# EAGLE design Pit Crew (EAGLE 6.6.0)

## Sheet 1 of 2
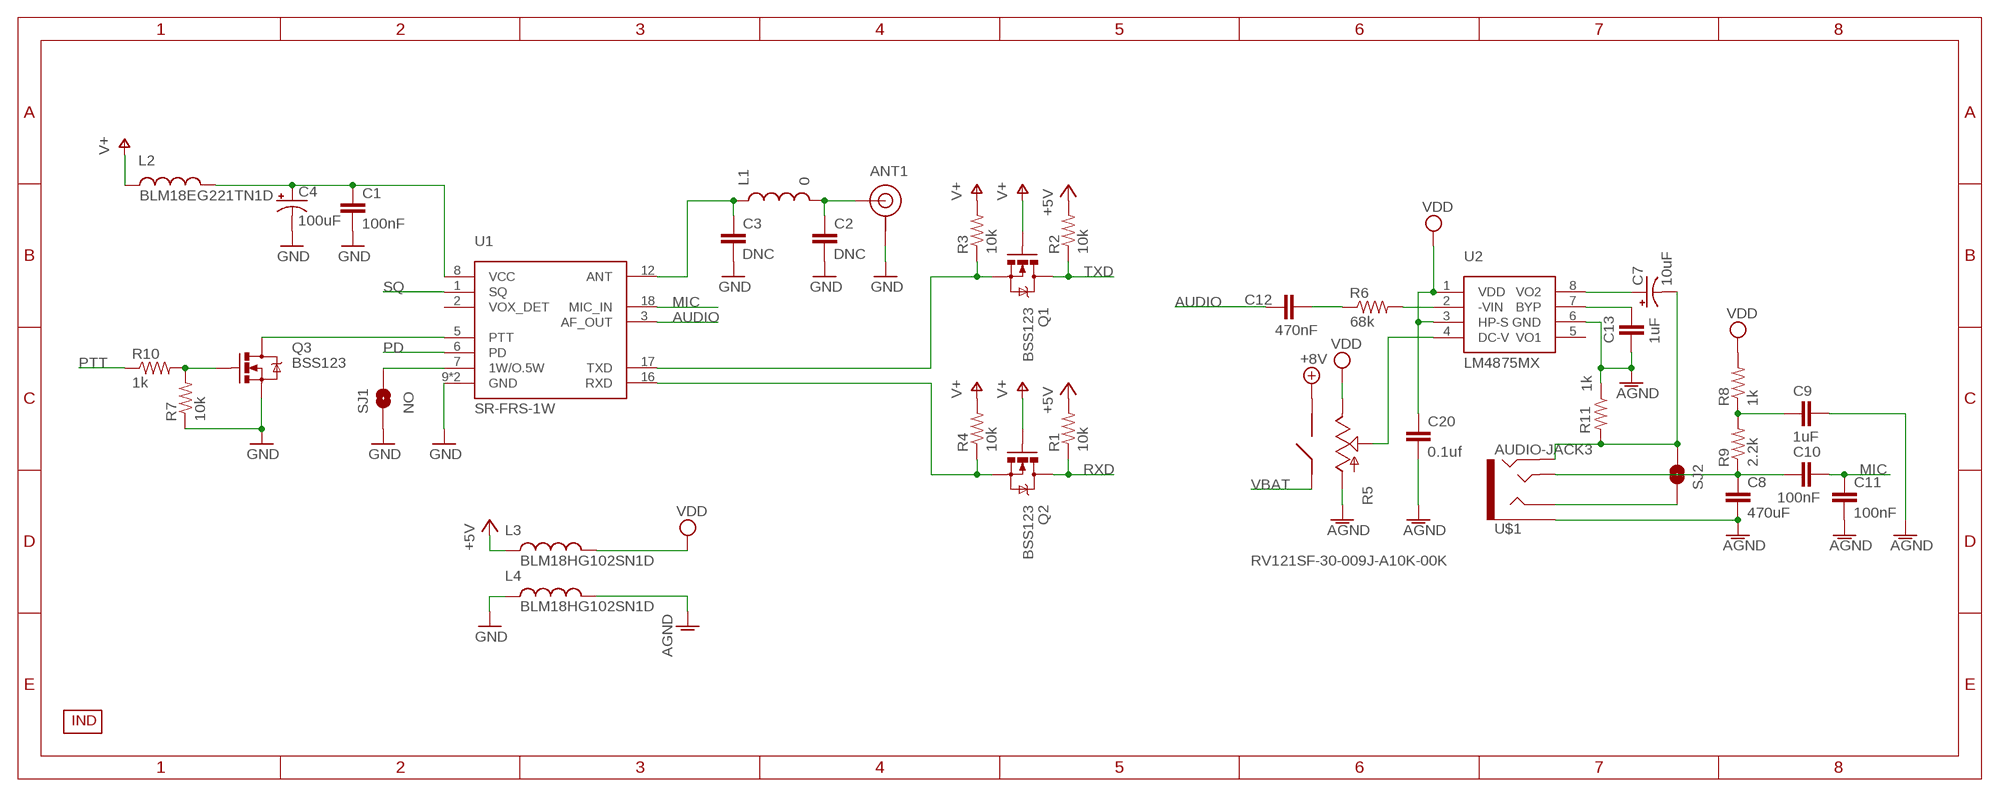
[diagram p0: schematic, sheet 1]

### Parts
ANT1  SMA  [CONSMA002]
C1  100nF  CAP0805  [0805]
C2  DNC  CAP0805  [0805]
C3  DNC  CAP0805  [0805]
C4  100uF  CAP_POL1206  [EIA3216]
C7  10uF  10UF-TANT  [EIA3216]
C8  470uF  CAP0805  [0805]
C9  1uF  CAP0805  [0805]
C10  100nF  CAP0805  [0805]
C11  100nF  CAP0805  [0805]
C12  470nF  CAP0805  [0805]
C13  1uF  CAP0805  [0805]
C20  0.1uf  CAP0805  [0805]
L1  0  INDUCTOR1007  [1007]
L2  BLM18EG221TN1D  INDUCTOR0603  [0603]
L3  BLM18HG102SN1D  INDUCTOR0603  [0603]
L4  BLM18HG102SN1D  INDUCTOR0603  [0603]
Q1  BSS123  MOSFET-NCHANNELBSS123LT1G  [SOT23]
Q2  BSS123  MOSFET-NCHANNELBSS123LT1G  [SOT23]
Q3  BSS123  MOSFET-NCHANNELBSS123LT1G  [SOT23]
R1  10k  RESISTOR0805-RES  [0805]
R2  10k  RESISTOR0805-RES  [0805]
R3  10k  RESISTOR0805-RES  [0805]
R4  10k  RESISTOR0805-RES  [0805]
R5  RV121SF-30-009J-A10K-00K  [RV121SF-30-009J-A10K-00K]
R6  68k  RESISTOR0805-RES  [0805]
R7  10k  RESISTOR0805-RES  [0805]
R8  1k  RESISTOR0805-RES  [0805]
R9  2.2k  RESISTOR0805-RES  [0805]
R10  1k  RESISTOR0805-RES  [0805]
R11  1k  RESISTOR0805-RES  [0805]
SJ1  NO  SOLDERJUMPERNO  [SJ_2S-NO]
SJ2  SOLDERJUMPERNO  [SJ_2S-NO]
U1  SR-FRS-1W  [SR-FRS-1W]
U2  LM4875MX  [SO-8]
U$1  AUDIO-JACK3  [AUDIO-JACK-TRRS-SMD]
U$3  INDPK1  [PICKIT-PIN-1]

### Nets
+5V: L3.1 R1.2 R2.2 ; also sheet 2
+8V: R5.S-A(S1) ; also sheet 2
AGND: C8.2 C9.2 C11.2 C13.1 C20.2 L4.2 R5.CC(A) R11.1 U2.6(GND) U$1.EARTH
AUDIO: C12.1 U1.3(AF_OUT)
GND: ANT1.1(GND) ANT1.2(GND) ANT1.3(GND) ANT1.4(GND) C1.2 C2.2 C3.2 C4.C(-) L4.1 Q3.2(S) R7.1 SJ1.1 U1.9(GND) U1.10(GND) ; also sheet 2
MIC: C10.2 C11.1 U1.18(MIC_IN)
N$1: C3.1 L1.1 U1.12(ANT)
N$2: ANT1.C(SIGNAL) C2.1 L1.2
N$3: C1.1 C4.A(+) L2.2 U1.8(VCC)
N$4: SJ1.2 U1.7(1W/O.5W)
N$5: SJ2.1 U$1.RING1
N$6: C7.C(-) R11.2 SJ2.2 U$1.RING2
N$7: R5.W(S) U2.4(DC-V)
N$8: Q2.2(S) R4.1 U1.16(RXD)
N$9: Q1.2(S) R3.1 U1.17(TXD)
N$10: C13.2 U2.7(BYP)
N$12: C12.2 R6.1
N$14: R6.2 U2.2(-VIN)
N$15: C9.1 R8.1 R9.2
N$16: C8.1 C10.1 R9.1 U$1.TIP
N$17: C7.A(+) U2.8(VO2)
N$18: Q3.1(G) R7.2 R10.2
PD: U1.6(PD) ; also sheet 2
PTT: R10.1 ; also sheet 2
PTT-1: Q3.3(D) U1.5(PTT)
RXD: Q2.3(D) R1.1 ; also sheet 2
SQ: U1.1(SQ)
TXD: Q1.3(D) R2.1 ; also sheet 2
V+: L2.1 Q1.1(G) Q2.1(G) R3.2 R4.2 ; also sheet 2
VBAT: R5.S-B(S2) ; also sheet 2
VDD: C20.1 L3.2 R5.CCW(E) R8.2 U2.1(VDD) U2.3(HP-S)
Unconnected: U1.2(VOX_DET) U2.5(VO1)

## Sheet 2 of 2
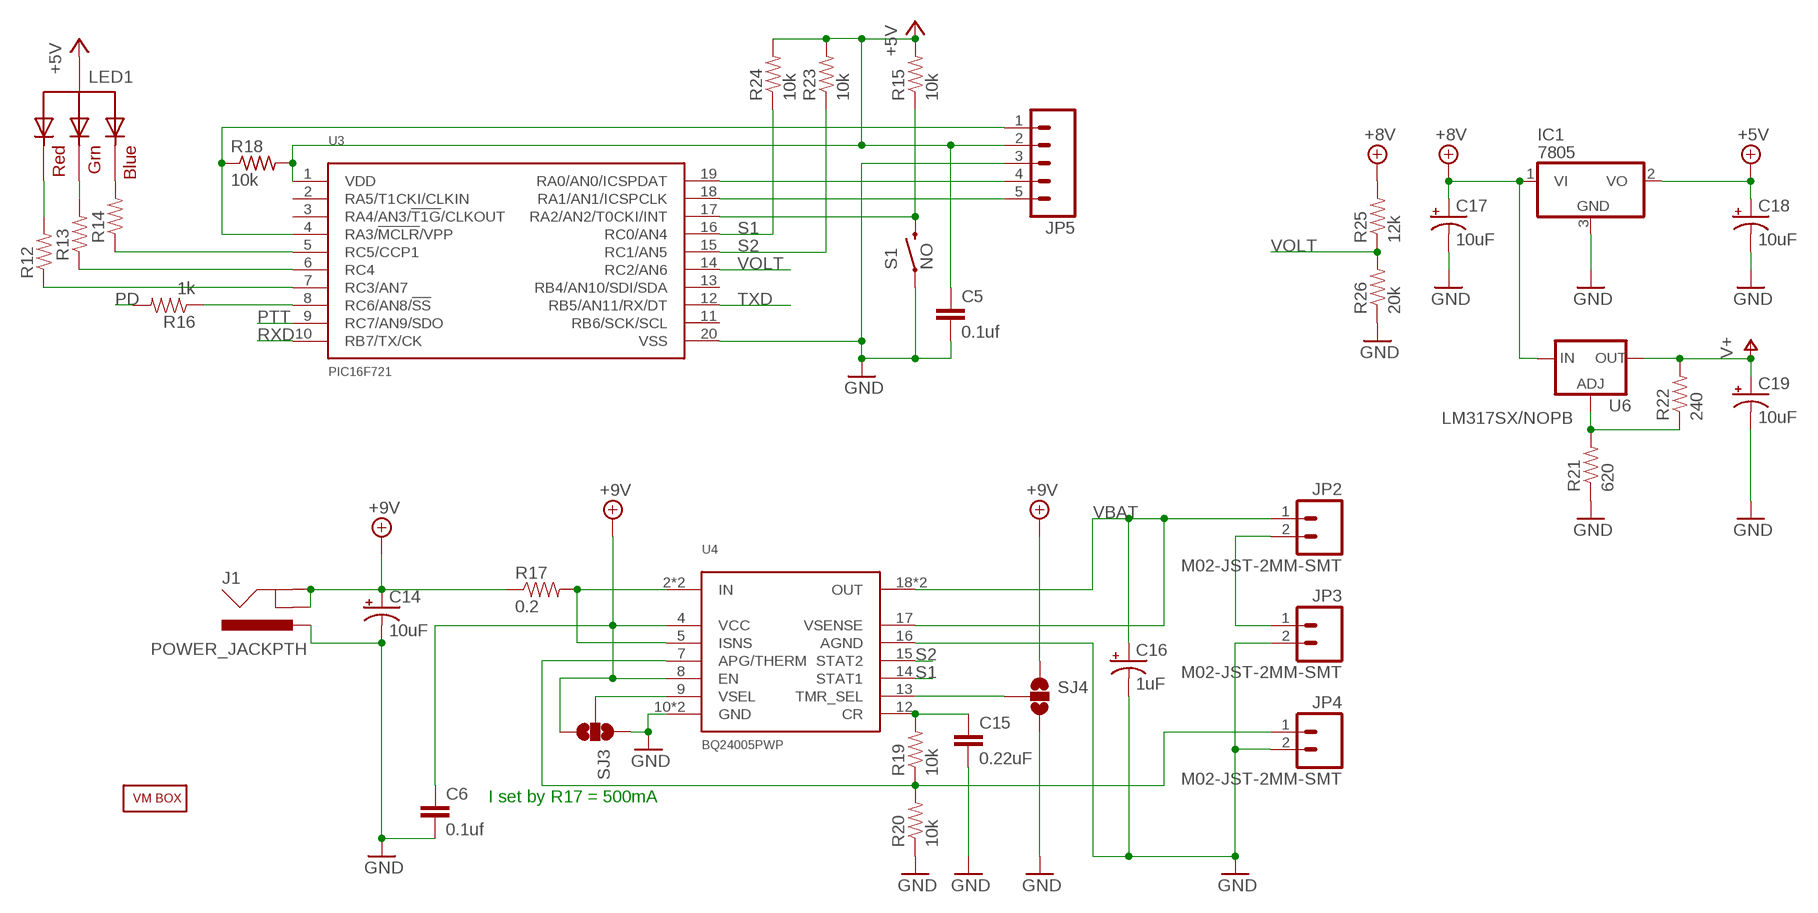
[diagram p1: schematic, sheet 2]

### Parts
C5  0.1uf  CAP0805  [0805]
C6  0.1uf  CAP0805  [0805]
C14  10uF  10UF-TANT  [EIA3216]
C15  0.22uF  CAP0805  [0805]
C16  1uF  10UF-TANT  [EIA3216]
C17  10uF  10UF-TANT  [EIA3216]
C18  10uF  10UF-TANT  [EIA3216]
C19  10uF  10UF-TANT  [EIA3216]
IC1  7805  7806DT  [TO252]
J1  POWER_JACKPTH  [POWER_JACK_PTH]
JP2  M02-JST-2MM-SMT  [JST-2-SMD]
JP3  M02-JST-2MM-SMT  [JST-2-SMD]
JP4  M02-JST-2MM-SMT  [JST-2-SMD]
JP5  M05LOCK_LONGPADS  [1X05_LOCK_LONGPADS]
LED1  RGBLED_CA-5MM  [LED5MMRGB]
R12  RESISTOR0805-RES  [0805]
R13  RESISTOR0805-RES  [0805]
R14  RESISTOR0805-RES  [0805]
R15  10k  RESISTOR0805-RES  [0805]
R16  1k  RESISTOR0805-RES  [0805]
R17  0.2  RESISTOR2512  [R2512]
R18  10k  R-US_R0805  [R0805]
R19  10k  RESISTOR0805-RES  [0805]
R20  10k  RESISTOR0805-RES  [0805]
R21  620  RESISTOR0805-RES  [0805]
R22  240  RESISTOR0805-RES  [0805]
R23  10k  RESISTOR0805-RES  [0805]
R24  10k  RESISTOR0805-RES  [0805]
R25  12k  RESISTOR0805-RES  [0805]
R26  20k  RESISTOR0805-RES  [0805]
S1  NO  SWITCH-MOMENTARY-2SIDE_EZ  [TACTILE-PTH-SIDEEZ]
SJ3  SOLDERJUMPER_2WAYS  [SJ_3]
SJ4  SOLDERJUMPER_2WAYS  [SJ_3]
U3  PIC16F721  [SSOP-20]
U4  BQ24005PWP  [HTSSOP-20]
U6  LM317SX/NOPB  V_REG_317  [D2PACK/A]
U$2  VM  [VM-35]

### Nets
+5V: C5.1 C18.A(+) IC1.2(VO) JP5.2 LED1.2(VCC) R15.2 R18.2 R23.2 R24.2 U3.1(VDD) ; also sheet 1
+8V: C17.A(+) IC1.1(VI) R25.2 U6.3(IN) ; also sheet 1
+9V: C6.1 C14.A(+) J1.GND J1.GNDBREAK R17.1 SJ3.3 SJ4.1 U4.4(VCC) U4.8(EN)
GND: C5.2 C6.2 C14.C(-) C15.2 C16.C(-) C17.C(-) C18.C(-) C19.C(-) IC1.3(GND) J1.PWR JP3.2 JP4.2 JP5.3 R20.1 R21.1 R26.1 S1.1 SJ3.1 SJ4.3 U3.20(VSS) U4.10(GND) U4.16(AGND) U4.EP(GND) ; also sheet 1
N$11: LED1.1(RED) R12.2
N$13: LED1.4(BLUE) R14.2
N$19: LED1.3(GREEN) R13.2
N$21: R14.1 U3.5(RC5/CCP1)
N$22: R13.1 U3.6(RC4)
N$23: R12.1 U3.7(RC3/AN7)
N$24: R15.1 S1.2
N$25: R16.1 U3.8(RC6/AN8/!SS!)
N$27: JP5.1 R18.1 U3.4(RA3/!MCLR!/VPP)
N$28: JP5.4 U3.19(RA0/AN0/ICSPDAT)
N$29: JP5.5 U3.18(RA1/AN1/ICSPCLK)
N$30: JP2.2 JP3.1
N$31: R17.2 U4.2(IN) U4.3(IN) U4.5(ISNS)
N$32: R21.2 R22.1 U6.1(ADJ)
N$33: SJ3.2 U4.9(VSEL)
N$34: JP4.1 R19.1 R20.2 U4.7(APG/THERM)
N$35: C15.1 R19.2 U4.12(CR)
N$36: SJ4.2 U4.13(TMR_SEL)
PD: R16.2 ; also sheet 1
PTT: U3.9(RC7/AN9/SDO) ; also sheet 1
RXD: U3.10(RB7/TX/CK) ; also sheet 1
S1: R24.1 U3.16(RC0/AN4) U4.14(STAT1)
S2: R23.1 U3.15(RC1/AN5) U4.15(STAT2)
TXD: U3.12(RB5/AN11/RX/DT) ; also sheet 1
V+: C19.A(+) R22.2 U6.2(OUT) U6.TAB(OUT) ; also sheet 1
VBAT: C16.A(+) JP2.1 U4.17(VSENSE) U4.18(OUT) U4.19(OUT) ; also sheet 1
VOLT: R25.1 R26.2 U3.14(RC2/AN6)
Unconnected: U3.2(RA5/T1CKI/CLKIN) U3.3(RA4/AN3/!T1G!/CLKOUT) U3.11(RB6/SCK/SCL) U3.13(RB4/AN10/SDI/SDA) U3.17(RA2/AN2/T0CKI/INT)

### Notes on the sheet
- I set by R17 = 500mA

## Library data of the parts
ANT1 = FSAE Eletric:SMA
C1-C3 C8-C13 C15 C20 = SparkFun-Passives:CAP: Capacitor Standard 0603 ceramic capacitor, and 0.1" leaded capacitor.
C4 = SparkFun-Passives:CAP_POL: Capacitor Polarized These are standard SMD and PTH capacitors. Normally 10uF, 47uF, and 100uF in electrolytic and tantalum varieties. Always verify the external diameter of the through hole cap, it varies with capacity, voltage, and manufacturer. The EIA devices should be standard.
C5 C6 = SparkFun-Capacitors:CAP: Capacitor Standard 0603 ceramic capacitor, and 0.1" leaded capacitor.
C7 C14 C17-C19 = SparkFun-Capacitors:10UF-TANT: 10uF Tantalum SMT CAP-00811- 16V 10% (EIA-3216); PROD_ID: CAP-00811
C16 = SparkFun-Capacitors:10UF-TANT: 10uF Tantalum SMT CAP-00811- 16V 10% (EIA-3216); PROD_ID: CAP-00811; VALUE: 10uF
IC1 = adafruit:78*: Positive VOLTAGE REGULATOR Added bigger pads to the TO-92 package
J1 = SparkFun-Connectors:POWER_JACK: Power Jack This is the standard 5.5mm barrel jack for power. The PTH is the most common, proven, reliable, footprint. The Slot footprint only works if the mill layer is transmitted to the PCB fab house so be warned. Spark Fun Electronics SKU : PRT-00119 SMT: CONN-08106 Mating wall wart : TOL-00298 (and others)
JP2-JP4 = SparkFun-Connectors:M02: Standard 2-pin 0.1" header. Use with - straight break away headers ( PRT-00116) - right angle break away headers (PRT-00553) - swiss pins (PRT-00743) - machine pins (PRT-00117) - female headers (PRT-00115) Molex polarized connector foot print use with: PRT-08233 with associated crimp pins and housings. 2.54_SCREWTERM for use with PRT-10571. 3.5mm Screw Terminal footprints for PRT-08084 5mm Screw Terminal footprints for use with PRT-08433; PROD_ID: CONN-08352
JP5 = SparkFun-Connectors:M05: Header 5 Standard 5-pin 0.1" header. Use with straight break away headers (SKU : PRT-00116), right angle break away headers (PRT-00553), swiss pins (PRT-00743), machine pins (PRT-00117), and female headers (PRT-00115). Molex polarized connector foot print use with SKU : PRT-08230 with associated crimp pins and housings.
L1-L4 = SparkFun-Passives:INDUCTOR: Inductors Basic Inductor/Choke - 0603 and 1206. Footprints are not proven and vary greatly between part numbers. SRN6045- 33uH, 20% 1.4A
LED1 = adafruit:RGBLED_CA: RGB LED, common-anode 5MM Staggered pins 5mm Piranha package http://www.ladyada.net/library/pcb/eaglelibrary.html
Q1-Q3 = SparkFun-DiscreteSemi:MOSFET-NCHANNEL: Common NMOSFET Parts MFG P/N Store ID Prod ID FDD8780 TRANS-09984 SI7820DN TRANS-11055 FDS6630A IC-08089 2N7002PW TRANS-11151 FQP30N06L COM-10213 TRANS-10060 BSS123LT1G TRANS-08345 BSS138 TRANS-00830 BS170 2N7000; PROD_ID: TRANS-08345
R1-R4 R6-R17 R19-R26 = SparkFun-Passives:RESISTOR: Resistor Basic schematic elements and footprints for 0603, 1206, and PTH resistors.
R5 = FSAE Eletric:RV121SF-30-009J-A10K-00K
R18 = adafruit:R-US_: RESISTOR, American symbol
S1 = SparkFun-Electromechanical:SWITCH-MOMENTARY-2: Various NO switches- pushbuttons, reed, etc
SJ1 SJ2 = SparkFun-Passives:SOLDERJUMPER: Solder Jumper Standard SMD solder jumper. Used to automate production. Two varients : Normally Open and Normally Closed are the same, but have different paste layers. NC will have a large amount of paste and should jumper during reflow.
SJ3 SJ4 = SparkFun-Passives:SOLDERJUMPER_2WAY: Solder Jumper 2 way solder jumper
U1 = FSAE Eletric:SR-FRS-1W
U2 = FSAE Eletric:LM4875MX
U3 = FSAE Eletric:PIC16F721
U4 = FSAE Eletric:BQ24005PWP
U6 = SparkFun-PowerIC:V_REG_317: Voltage Regulator Standard LM317 adjustable voltage regulator. AOI (Adjust Output Input). Google 'LM317 Calculator' for easy to use app to get the two resistor values needed. 240/720 for 5V output. 240/390 for 3.3V output. Spark Fun Electronics SKU : COM-00527
U$1 = SparkFun-Connectors:AUDIO-JACK3: Audio jack - 3.5mm TRRS variety - two rings.
U$2 = FSAE Eletric:VM
U$3 = FSAE Eletric:IND

## Board
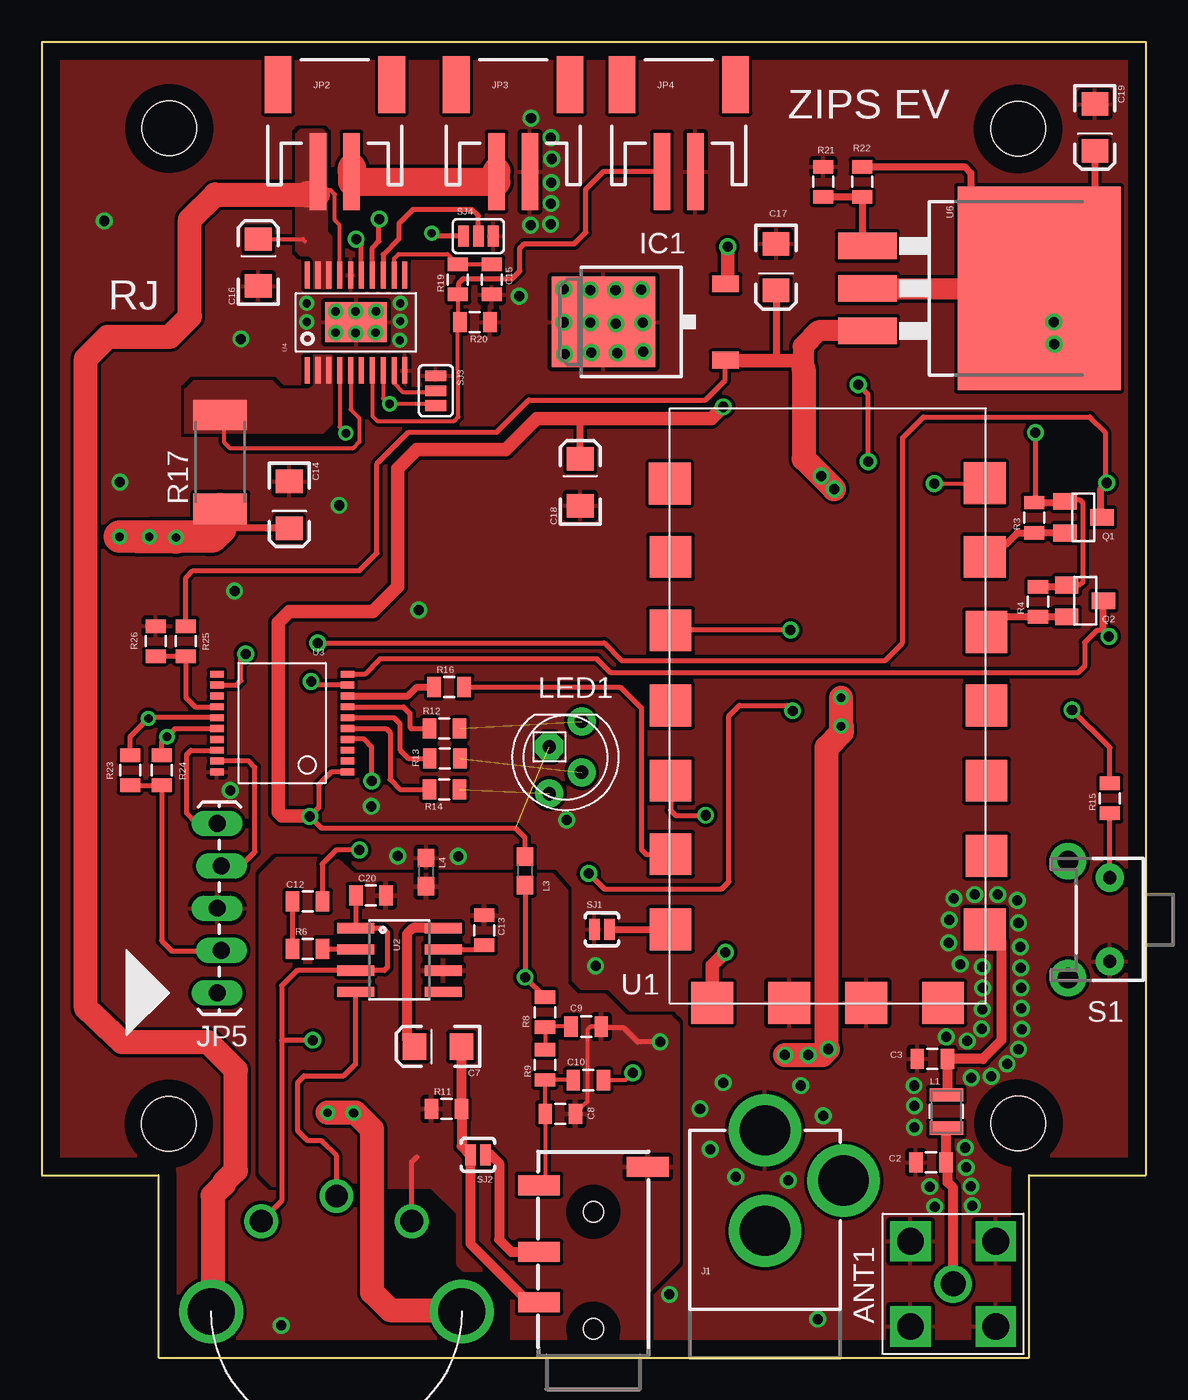
[diagram p2: board, top side]
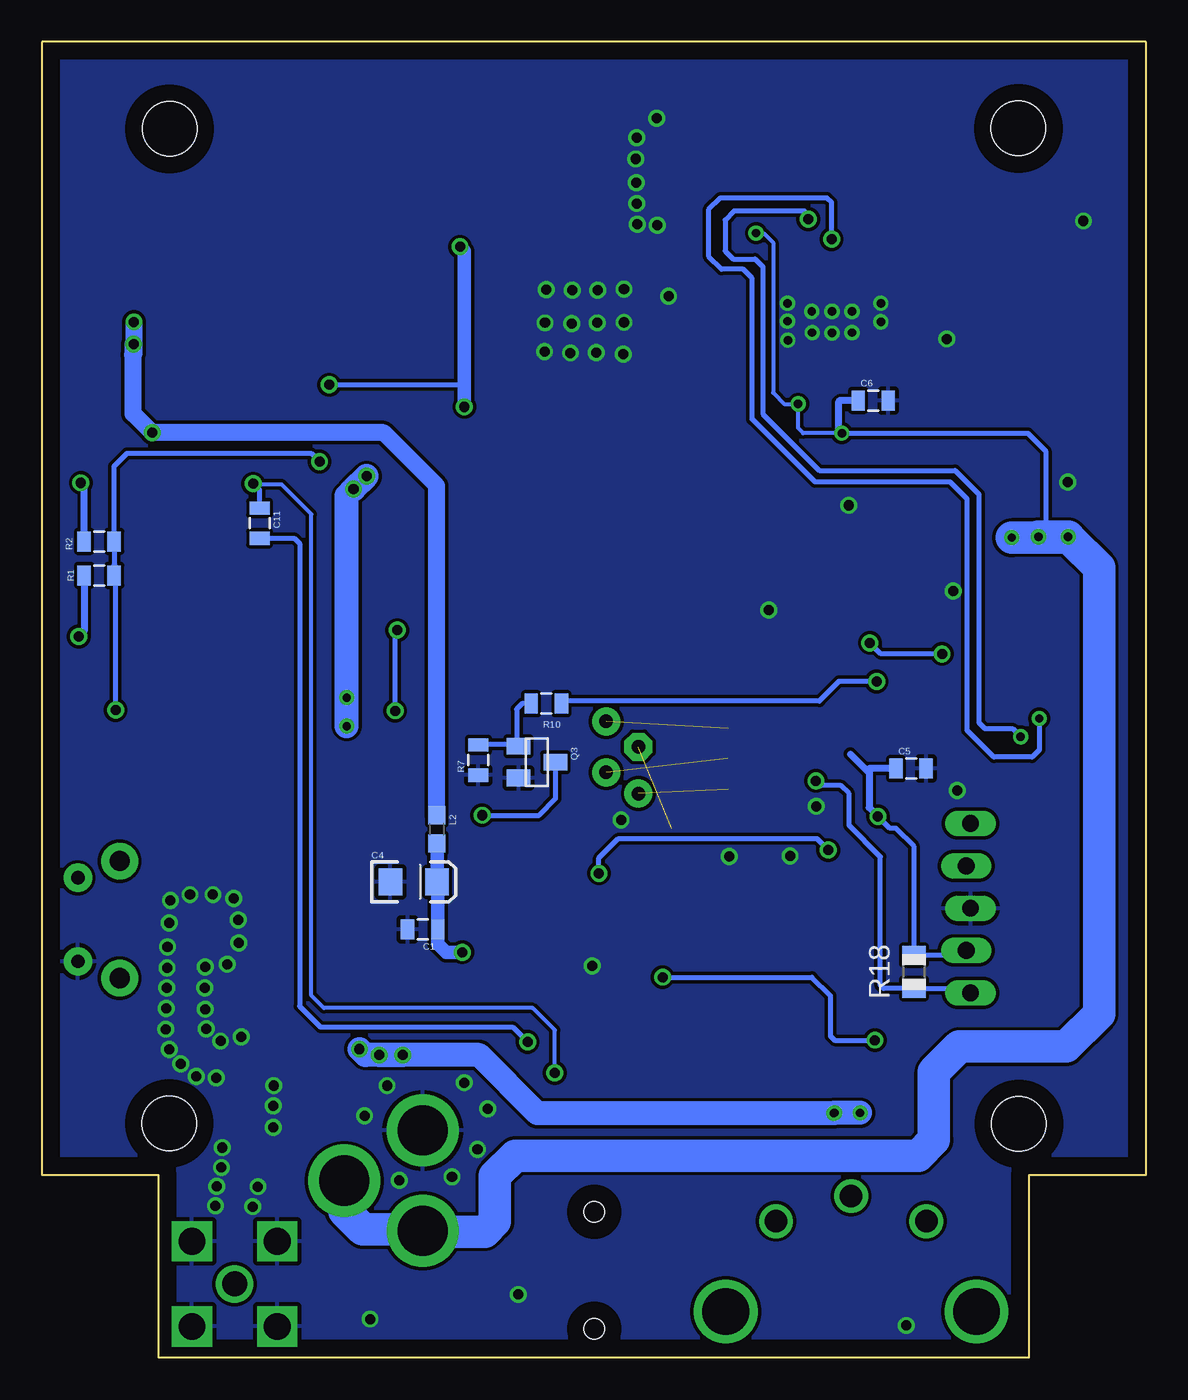
[diagram p3: board, bottom side, seen from below]

Size 66.04 x 78.74 mm. Coordinates in mm from the lower left corner, seen from the top.
Copper layers (1*16): Top 0.035mm / dielectric 1.5mm / Bottom 0.035mm
Design rules "default": minimum track width 10mil, minimum drill 24mil, track to track 8mil, track to pad 8mil, pad to pad 8mil, via to via 8mil, smd to smd 8mil, copper to edge 40mil, drill to drill 8mil, minimum pad ring 10mil, minimum via ring 8mil, stop-mask expansion 4mil, vias tented up to drill 0mil, thermal gap 10mil

### Footprints (pad centres in the part's own frame; a part is rotated, then mirrored left to right if it is on the bottom)
CONSMA002 = drill 1.6 square: 1 -2.55,2.55; 2 2.55,2.55; 3 2.55,-2.55; 4 -2.55,-2.55 | drill 1.5: C 0,0
0805 = smd 0.8 x 1.2: 1 -0.9,0; 2 0.9,0
EIA3216 = smd 1.4 x 1.6: A 1.4,0; C -1.4,0
TO252 = smd 1 x 1.6: 1 -2.28,-4.8; 2 2.28,-4.8 | smd 5.4 x 6.2: 3 0,2.5
POWER_JACK_PTH = drill 2.997 pad 4.318: GND 0,7.7; GNDBREAK 4.7,10.7; PWR 0,13.7
JST-2-SMD = smd 1 x 4.6: 1 -1,-3.7; 2 1,-3.7 | smd 1.6 x 3.4: NC1 -3.4,1.5; NC2 3.4,1.5
1X05_LOCK_LONGPADS = drill 1.016 long: 1 0,0; 2 2.54,-0.254; 3 5.08,0; 4 7.62,-0.254; 5 10.16,0
1007 = smd 2 x 0.8: 1 0,1; 2 0,-1
0603 = smd 1.1 x 1: 1 -0.85,0; 2 0.85,0
LED5MMRGB = drill 0.8 pad 1.676: 1 -2.159,0.968; 3 0.889,0.968; 4 2.159,-0.968 | drill 0.8 pad 1.676 octagon: 2 -0.635,-0.968
SOT23 = smd 1 x 1.4: 1 -0.95,-1.1; 2 0.95,-1.1; 3 0,1.1
RV121SF-30-009J-A10K-00K = drill 1.35: CC -4.5,-5.4; CCW 4.5,-5.4; W 0,-6.9 | drill 2.8: S-A -7.5,0; S-B 7.5,0
R2512 = smd 1.8 x 3.2: 1 -2.8,0; 2 2.8,0
R0805 = smd 1.1 x 1.4: 1 -1,0; 2 1,0
TACTILE-PTH-SIDEEZ = drill 0.8 pad 1.7: 1 -2.5,0; 2 2.5,0 | drill 1.2 pad 2.2: ANCHOR1 -3.5,2.5; ANCHOR2 3.5,2.5
SJ_2S-NO = smd 0.635 x 1.27: 1 -0.45,0; 2 0.45,0
SJ_3 = smd 0.635 x 1.27: 1 -0.889,0; 2 0,0; 3 0.889,0
SR-FRS-1W = smd 2.5 x 2.5: 1 0,31.1; 2 0.04,26.72; 3 0.04,22.32; 4 0.04,17.82; 5 0.04,13.32; 6 0.04,8.92; 7 0.04,4.42; 8 2.54,0.02; 9 7.14,0.02; 10 11.74,0.02; 11 16.34,0.02; 12 18.84,4.42; 13 18.94,8.82; 14 18.94,13.32; 15 18.94,17.82; 16 18.94,22.22; 17 18.84,26.72; 18 18.84,31.12
SO-8 = smd 0.61 x 2.21: 1 -1.905,-2.616; 2 -0.635,-2.616; 3 0.635,-2.616; 4 1.905,-2.616; 5 1.905,2.616; 6 0.635,2.616; 7 -0.635,2.616; 8 -1.905,2.616
SSOP-20 = smd 0.813 x 0.406: 1 -3.9,2.925; 2 -3.9,2.275; 3 -3.9,1.625; 4 -3.9,0.975; 5 -3.9,0.325; 6 -3.9,-0.325; 7 -3.9,-0.975; 8 -3.9,-1.625; 9 -3.9,-2.275; 10 -3.9,-2.925; 11 3.9,-2.925; 12 3.9,-2.275; 13 3.9,-1.625; 14 3.9,-0.975; 15 3.9,-0.325; 16 3.9,0.325; 17 3.9,0.975; 18 3.9,1.625; 19 3.9,2.275; 20 3.9,2.925
HTSSOP-20 = smd 0.3 x 1.6: 1 -2.925,-2.9; 2 -2.275,-2.9; 3 -1.625,-2.9; 4 -0.975,-2.9; 5 -0.325,-2.9; 6 0.325,-2.9; 7 0.975,-2.9; 8 1.625,-2.9; 9 2.275,-2.9; 10 2.925,-2.9; 11 2.925,2.8; 12 2.275,2.8; 13 1.625,2.8; 14 0.975,2.8; 15 0.325,2.8; 16 -0.325,2.8; 17 -0.975,2.8; 18 -1.625,2.8; 19 -2.275,2.8; 20 -2.925,2.8 | smd 3.7 x 2.4: EP 0,0
D2PACK/A = smd 1.6 x 3.5: 1 -2.54,-8.275; 2 0,-8.275; 3 2.54,-8.275 | smd 12.2 x 9.75: TAB 0,2
AUDIO-JACK-TRRS-SMD = smd 1.2 x 2.5: EARTH 11.3,-3.25; RING1 6.2,3.25; RING2 3.2,3.25; TIP 10.2,3.25 | hole 1.2: 1.6,0; 8.6,0
VM-35 = hole 3.251: -25.425,13.995; 25.4,14.021; 25.375,73.533; -25.4,73.558

### Placement (x,y rotation side)
ANT1  54.51,4.42 0 top
C1  43.26,25.63 180 bottom
C2  53.19,11.68 180 top
C3  53.26,17.88 180 top
C4  43.79,28.47 0 bottom
C5  14.05,35.26 0 bottom
C6  16.31,57.28 0 bottom
C7  23.7,18.62 180 top
C8  31.01,14.61 0 top
C9  32.56,19.81 0 top
C10  32.69,16.61 0 top
C11  53.01,49.94 270 bottom
C12  15.9,27.3 180 top
C13  26.47,25.58 270 top
C14  14.81,51.03 270 top
C15  26.92,64.52 270 top
C16  12.95,65.53 90 top
C17  43.92,65.25 270 top
C18  32.21,52.37 90 top
C19  62.99,73.61 270 top
C20  19.68,27.66 0 top
IC1  36.09,61.98 90 top
J1  43.26,-0.1 0 top
JP2  17.53,74.68 0 top
JP3  28.19,74.68 0 top
JP4  38.1,74.68 0 top
JP5  10.49,21.82 90 top
L1  54.1,14.73 0 top
L2  42.42,31.62 270 bottom
L3  28.91,29.13 270 top
L4  22.99,29.06 270 top
LED1  31.32,35.92 270 top
Q1  62.31,50.29 270 top
Q2  62.41,45.29 270 top
Q3  36.42,35.64 270 bottom
R1  62.61,46.81 0 bottom
R2  62.61,48.84 0 bottom
R3  59.36,50.27 90 top
R4  59.59,45.24 90 top
R5  17.63,2.77 180 top
R6  15.9,24.46 0 top
R7  39.93,35.76 90 bottom
R8  30.1,20.68 90 top
R9  30.1,17.53 90 top
R10  35.86,39.14 180 bottom
R11  24.21,14.88 0 top
R12  24.08,37.64 0 top
R13  24.1,35.86 0 top
R14  24.08,34.01 0 top
R15  63.88,33.48 90 top
R16  24.36,40.13 0 top
R17  10.67,53.59 90 top
R18  13.87,23.09 90 bottom
R19  24.89,64.52 90 top
R20  25.91,61.98 180 top
R21  46.74,70.36 270 top
R22  49.07,70.36 90 top
R23  5.28,35.15 270 top
R24  7.16,35.15 270 top
R25  8.61,42.88 90 top
R26  6.81,42.88 270 top
S1  63.88,26.21 90 top
SJ1  33.5,25.63 0 top
SJ2  26.09,12.14 180 top
SJ3  23.57,57.86 270 top
SJ4  26.11,67.11 0 top
U1  37.57,21.21 0 top
U2  21.39,23.8 270 top
U3  14.38,37.97 180 top
U4  18.8,61.98 0 top
U6  57.66,63.98 270 top
U$1  32.99,0.13 90 top
U$2  33.02,0 0 top
U$3  7.62,21.84 90 top

### Tracks (layer width: path | path; a pad name or v marks a point on that pad's centre or on a via)
+5V  (via drill 0.6)  (1 unrouted)
  Top 0.305: R15.2 63.88,36.5 v61.62,38.76 | R23.2 R24.2 7.16,24.94 7.77,24.33 10.72,24.33 JP5.2 | U3.1 17.32,35.05 16.56,34.29 16.56,32.92 v16.03,32.38 16.74,31.67 28.35,31.67 28.91,31.11 L3.1 | v49.43,53.62 49.43,57.63 v48.84,58.22
  Top 0.406: C18.A 32.21,56.11 32.13,56.18
  Top 0.813: v16.03,32.38 16,32.41 14.35,32.41 14.15,32.61 14.15,43.99 14.81,44.65 19.79,44.65 21.29,46.15 21.29,53.19 22.43,54.33 27.74,54.33 29.59,56.18 32.13,56.18 40.06,56.18 v40.77,56.9 | v41.02,66.47 41.02,64.38 IC1.2
  Bottom 0.305: 61.71,47.45 R2.2 61.71,53.35 60.93,54.13 49.94,54.13 v49.43,53.62 | 61.71,47.45 R1.2 | v61.62,38.76 61.62,47.36 61.71,47.45 | JP5.2 11.01,24.09 R18.2 13.87,30.58 14.96,31.67 15.32,31.67 v16.03,32.38 | v48.84,58.22 40.89,58.22 40.77,58.09
  Bottom 0.406: 17.68,36.12 16.56,35 | 16.56,35 16.56,32.92 v16.03,32.38 | C5.1 16.56,35.26 16.56,35
  Bottom 0.813: v40.77,56.9 40.77,58.09 40.77,66.22 v41.02,66.47
+8V  (via drill 0.5, 0.6)
  Top 0.305: R25.2 8.61,46.66 9.04,47.09 19,47.09 20.04,48.13 20.04,53.49 21.92,55.37 27.2,55.37 29.13,57.3 39.67,57.3 40.87,58.5 40.87,59.67 IC1.1
  Top 0.406: C17.A 43.92,59.77 43.82,59.67
  Top 0.813: 40.92,59.67 43.82,59.67 45.49,59.67 45.54,59.61
  Top 1.016: 40.92,59.67 IC1.1
  Top 1.27: U6.3 46.46,61.44 45.54,60.53 45.54,59.61 45.54,59.21 45.57,59.18
  Top 1.422: v18.62,14.66 18.77,14.66 19.76,13.67 19.76,3.91 20.83,2.84 25.05,2.84 R5.S-A | v18.62,14.66 v17.09,14.66 | v18.62,14.66 18.64,14.66 v18.67,14.63 | v47.8,39.5 v47.8,37.8 47.85,37.74 47.85,37.44 46.94,36.53 46.94,18.39 46.66,18.11 | v44.45,18.11 v45.85,18.11 | v47.04,18.47 46.69,18.11 46.66,18.11 | 45.9,18.11 46.66,18.11 | v47.4,51.97 v46.61,52.76 45.57,53.8 45.57,59.18
  Bottom 1.422: v17.09,14.66 v18.62,14.66 | v18.67,14.63 36.4,14.63 39.88,18.11 v44.45,18.11 | v47.8,39.5 v47.8,37.8 47.8,51.56 v47.4,51.97 | v47.4,51.97 v46.61,52.76 | v45.85,18.11 v44.45,18.11 | v44.45,18.11 46.69,18.11 v47.04,18.47 | v47.4,51.97 47.37,51.97 46.61,52.73
+9V  (via drill 0.5)
  Top 0.254: 17.81,59.03 U4.4 17.82,55.69 v18.19,55.32 | 23.06,57.07 v20.8,57.07 20.42,57.4 U4.8
  Top 0.305: SJ4.1 23.5,67.11 v23.32,67.28 | 23.06,57.07 23.47,57.07 SJ3.3
  Top 0.406: C14.A 10.87,49.63 10.67,49.83
  Top 1.93: v4.65,49.12 5.61,49.12 | 5.61,49.12 v6.43,49.12 10.01,49.12 10.13,49.15 10.16,49.12 10.67,49.61 10.67,49.83 R17.1 | v8.03,49.07 5.74,49.1 5.61,49.12
  Bottom 0.254: v23.32,67.28 22.86,67.28 22.3,66.73 22.3,57.73 21.64,57.07 v20.8,57.07 20.8,55.63 20.5,55.32 v18.19,55.32
  Bottom 0.305: v18.19,55.32 7.06,55.32 5.99,54.25 5.99,49.61 5.97,49.58 5.97,49.23 5.87,49.12
  Bottom 0.406: C6.1 18.29,57.28 18.39,57.18 18.39,55.52 v18.19,55.32
  Bottom 1.93: 4.55,49.02 2.79,47.27 2.79,20.57 4.75,18.62 11.15,18.62 12.67,17.09 12.67,13.03 13.61,12.09 37.72,12.09 38.94,10.87 38.94,8.15 39.55,7.54 43.2,7.54 J1.GND 43.33,7.67 46.84,7.67 47.96,8.79 J1.GNDBREAK | v6.43,49.12 5.87,49.12 v4.65,49.12 4.55,49.02 | 4.55,49.02 4.65,49.07 v8.03,49.07
AGND  (via drill 0.6)
  Top 0.254: C9.2 32.84,19.81 32.64,19.61 32.64,15.33 C8.2
  Top 0.305: v36.98,18.9 35.64,18.9 34.8,19.74 33.54,19.74 C9.2 | R5.CC 22.13,11.71 22.43,12.01
  Bottom 0.305: C11.2 50.94,49.04 50.62,48.72 50.62,21.03 49.38,19.79 37.87,19.79 v36.98,18.9
  pour Top: 14.12,29.85 17.58,29.85 18.64,28.88 30.48,28.88 31.34,27.91 31.34,22.3 31.95,21.69 33.6,21.69 34.9,20.4 37.57,20.4 38,19.96 38,5.77 36.25,4.01 36.25,0.15 28.17,0.15 28.17,3.81 26.72,5.26 25.27,5.26 24.94,5.59 24.94,8.66 23.37,10.24 13.97,10.24 13.13,11.07 13.13,28.85
AUDIO  (via drill 0.6)
  Top 0.305: v32.72,28.98 33.66,28.04 40.67,28.04 41.1,28.47 41.1,38.4 41.73,39.04 44.58,39.04 v44.91,38.71 | v44.78,43.54 U1.3 | v19,30.38 17.6,30.38 16.76,29.54 16.76,27.34 C12.1
  Bottom 0.305: v44.91,38.71 44.91,43.41 v44.78,43.54 | v32.72,28.98 32.72,29.9 31.55,31.06 19.69,31.06 v19,30.38
GND  (via drill 0.5, 0.6)
  other vias: 15.85,63.09 15.85,61.98 17.58,62.61 18.77,62.61 19.99,62.61 17.58,61.34 18.77,61.32 19.96,61.34 21.44,63.09 21.44,62.03 21.41,60.88 22.56,44.73 30.45,73 30.43,67.82 30.51,71.73 30.48,70.31 30.45,69.06 29.24,67.77 29.26,74.17 31.27,60.05 31.22,61.95 31.22,63.93 32.87,60.15 32.82,61.93 32.79,63.88 34.42,60.12 34.34,61.87 34.32,63.88 35.97,60.2 35.94,61.93 35.86,63.91 17.78,51 11.53,45.87 4.67,52.4 11.91,60.96 3.73,68.02 14.33,1.93 37.54,3.78 46.41,2.31 39.37,14.88 40.77,16.46 58.42,26.01 45.39,16.28 46.74,14.48 44.65,10.62 41.5,10.82 39.98,12.47 58.52,24.59 58.55,23.32 58.57,22.12 58.6,20.9 58.62,19.66 58.42,18.44 57.73,17.58 56.79,16.84 55.6,16.74 55.35,18.95 56.21,19.69 56.26,20.85 56.29,22.12 56.26,23.39 52.17,16.28 54.1,19.2 52.2,15.06 52.2,13.79 55.24,12.57 55.3,11.38 55.58,10.26 55.65,9.09 53.42,9.04 53.11,10.24 11.28,33.93 28.55,63.53 58.34,27.36 57.18,27.71 55.8,27.71 54.56,27.48 54.28,26.19 54.25,24.82 54.94,23.55 24.92,30 21.29,30.02 33.12,23.44 31.39,32.18 19.71,32.99
  pour Top (rank 6): 0,78.74 66.04,78.74 66.12,10.79 59.18,10.92 59.18,0 6.76,0 6.86,10.92 0,10.92
  pour Bottom (rank 5): 0,78.74 66.04,78.74 66.04,10.92 59.18,10.92 59.18,0 6.86,0 6.86,10.92 0,10.92
MIC  (via drill 0.6)
  Top 0.254: C10.2 34.93,16.61 v35.36,17.04 | v53.39,52.3 56.38,52.3 U1.18
  Bottom 0.254: v35.36,17.04 35.36,19.61 36.68,20.93 49.17,20.93 49.91,21.67 49.91,50.47 51.69,52.25 53.34,52.25 v53.39,52.3
  Bottom 0.305: C11.1 53.01,51.92 v53.39,52.3
N$1
  Top 0.61: U1.12 56.67,25.63 57.4,24.89 57.4,19 56.29,17.88 C3.1 54.16,15.79 L1.1
N$2
  Top 0.61: L1.2 54.09,13.72 C2.1 54.18,11.59 54.18,10.49 54.51,10.16 ANT1.C
N$3  (via drill 0.6)
  Top 0.813: U1.8 40.11,23.47 v40.89,24.26
  Bottom 0.813: v40.89,24.26 41.83,24.26 42.34,24.76 42.34,25.61 C1.1 42.36,28.44 C4.A 42.39,30.74 L2.2
N$4
  Top 0.406: SJ1.2 U1.7 | U1.7
N$5
  Top 0.61: SJ2.1 26.85,12.14 27.36,11.63 27.36,7.06 28.09,6.32 U$1.RING1
N$6
  Top 0.61: C7.C 25.11,18.61 R11.2 25.11,12.67 SJ2.2 25.64,6.83 29.11,3.35 29.72,3.35 U$1.RING2
N$7
  Top 0.305: R5.W 17.63,12.06 16.71,12.98 15.9,12.98 15.32,13.56 15.32,16.48 15.7,16.87 18.06,16.87 18.77,17.58 U2.4
N$8
  Top 0.406: U1.16 56.56,43.43 57.48,44.35 59.58,44.35 R4.1 Q2.2
N$9
  Top 0.406: U1.17 56.92,47.93 58.34,49.35 59.35,49.35 R3.1 61.18,49.37 Q1.2
N$10
  Top 0.305: U2.7 26.22,24.43 C13.2
N$11  (1 unrouted)
N$12
  Top 0.305: R6.1 C12.2
N$13  (1 unrouted)
N$14
  Top 0.305: U2.2 16.83,24.43 R6.2
N$15
  Top 0.254: R8.1 | R8.1 R9.2 | C9.1 30.14,19.81 R8.1
N$16
  Top 0.254: R9.1 C8.1 30.11,10.7 U$1.TIP | C10.1 R9.1 | R9.1
N$17
  Top 0.61: U2.8 22.2,25.7 21.84,25.35 21.84,19.07 C7.A
N$18
  Bottom 0.305: R10.2 37.31,39.14 37.64,38.81 37.64,36.71 | 37.64,36.71 Q3.1 | 37.64,36.71 39.89,36.71 R7.2
N$19  (1 unrouted)
N$21
  Top 0.305: U3.5 20.59,37.65 20.83,37.41 20.83,34.59 21.41,34.01 R14.1
N$22
  Top 0.305: U3.6 21.06,38.3 21.41,37.95 21.41,36.37 21.92,35.86 R13.1
N$23
  Top 0.305: U3.7 21.63,38.95 22.02,38.56 22.02,37.72 22.1,37.64 R12.1
N$24
  Top 0.305: S1.2 R15.1
N$25
  Top 0.406: U3.8 21.89,39.6 22.43,40.13 R16.1
N$27  (via drill 0.6)
  Top 0.305: v19.74,34.52 19.74,36.55 19.28,37.01 18.29,37.01 U3.4
  Bottom 0.305: JP5.1 10.76,22.09 R18.1 15.69,22.09 15.88,22.28 15.88,29.97 17.75,31.85 17.75,33.76 18.24,34.24 19.46,34.24 v19.74,34.52
N$28
  Top 0.305: JP5.4 11.91,29.44 12.75,30.28 12.75,35.33 12.37,35.71 10.49,35.71 U3.19
N$29
  Top 0.305: JP5.5 9.27,31.98 8.66,32.59 8.66,36.09 8.92,36.35 U3.18
N$30
  Top 1.676: JP2.2 18.54,71.23 18.54,70.36 27.19,70.36 JP3.1
N$31
  Top 0.254: U4.5 18.47,56.74 19,56.21 19,54.81 18.59,54.41 11.28,54.41 10.92,54.76 10.92,56.14 R17.2
  pour Top (rank 5, no thermals): 16.26,59.94 17.27,59.94 17.27,55.88 16.76,55.37 8.64,55.37 8.64,57.91 9.14,58.42 13.72,58.42 14.22,57.91 16,57.91 16.26,58.17
N$32
  Top 0.406: R21.2 R22.1 49.07,66.83 U6.1
N$33
  Top 0.254: U4.9 21.07,58.3 21.59,57.78 23.06,57.78 SJ3.2
N$34
  Top 0.254: R19.1 24.89,62.09 R20.2 24.89,61.86 24.92,56.31 24.66,56.06 20.07,56.06 19.77,56.35 U4.7
  Top 0.305: JP4.1 33.59,70.98 32.51,69.9 32.54,69.88 32.54,67.34 31.85,66.65 28.85,66.65 28.6,66.4 28.6,65.02 28.14,64.57 25.22,64.57 24.92,64.26 24.92,63.64 R19.1
N$35
  Top 0.254: U4.12 21.07,65.77 21.34,66.04 24.27,66.04 R19.2 C15.1
N$36
  Top 0.305: SJ4.2 26.11,68.33 25.73,68.71 22.2,68.71 21.36,67.87 21.36,66.95 20.42,66.01 U4.13
PD
  Top 0.305: R16.2 34.59,40.13 35.86,38.86 35.86,30.4 36.17,30.1 37.58,30.1 U1.6
PTT  (via drill 0.6)
  Top 0.305: U3.9 16.32,40.25 v16.1,40.46
  Bottom 0.305: v16.1,40.46 18.36,40.46 19.53,39.29 34.81,39.29 R10.1
PTT-1  (via drill 0.6)
  Top 0.305: U1.5 37.61,32.75 37.92,32.44 39.67,32.44 v39.7,32.46
  Bottom 0.305: v39.7,32.46 36.3,32.46 35.31,33.45 35.31,35.62 Q3.3
RXD  (via drill 0.6)
  Top 0.305: 63.5,43.51 63.09,43.51 62.38,42.8 62.38,41.38 61.98,40.97 34.04,40.97 33.2,41.81 20.22,41.81 19.3,40.89 U3.10
  Top 0.406: v63.83,43.15 63.83,43.18 63.5,43.51 63.5,45.28 Q2.3
  Bottom 0.406: R1.1 63.51,43.47 v63.83,43.15
S1  (via drill 0.5, 0.6)
  Top 0.305: R24.1 7.16,36.83 v7.49,37.16 7.98,37.64 U3.16 | U4.14 19.77,66.41 20.17,66.8 20.17,68.1 v20.19,68.12
  Bottom 0.305: v20.19,68.12 20.19,68.38 20.42,68.61 24.64,68.61 25.17,68.07 25.17,66.22 24.69,65.74 23.37,65.74 22.91,65.28 22.91,56.46 19.53,53.09 11.4,53.09 9.98,51.66 9.98,38 9.63,37.64 7.98,37.64 v7.49,37.16
S2  (via drill 0.5, 0.6)
  Top 0.305: R23.1 5.28,37.16 v6.38,38.25 6.43,38.3 U3.15 | U4.15 19.12,66.6 v18.8,66.93
  Bottom 0.305: v18.8,66.93 18.8,69.11 19.08,69.39 25.45,69.39 26.16,68.68 26.16,65.91 25.37,65.13 24.08,65.13 23.55,64.59 23.55,56.16 19.79,52.4 11.71,52.4 10.69,51.38 10.69,37.54 9.09,35.94 6.81,35.94 6.38,36.37 v6.38,38.25
TXD  (via drill 0.6)
  Top 0.305: U3.12 11.65,40.25 11.91,40.51 11.91,41.83 v12.19,42.11 | v16.51,42.77 33.63,42.77 34.67,41.73 50.44,41.73 51.49,42.77 51.49,55.04 52.73,56.29 62.69,56.29 63.6,55.37 63.6,52.45 v63.7,52.35
  Top 0.406: v63.7,52.35 63.32,51.97 63.32,50.38 Q1.3
  Bottom 0.305: v12.19,42.11 15.85,42.11 v16.51,42.77
  Bottom 0.406: R2.1 63.51,52.18 v63.7,52.35
V+  (via drill 0.6)
  Top 0.305: Q2.1 62.06,46.24 62.28,46.43 62.28,51.13 62.1,51.31 61.27,51.31 Q1.1 | v59.44,55.35 59.44,51.24 R3.2 | 61.77,65.4 60.2,63.83
  Top 0.406: R4.2 61.21,46.14 Q2.1 | R3.2 61.13,51.17 Q1.1 | R22.2 55.21,71.26 55.58,70.89 55.58,68.76 | 55.58,68.76 55.52,68.71 | 55.58,68.76 55.58,65.68 57.28,63.98 | C19.A 62.99,66.62 61.77,65.4
  Top 1.016: v60.55,60.66 60.55,61.95 v60.53,61.98 60.76,62.2
  Top 1.27: U6.2 57.28,63.98 U6.TAB | U6.TAB 60.05,63.98 | 60.05,63.98 60.2,63.83 59.81,63.83 U6.TAB | 60.05,63.98 60.05,62.46 v60.53,61.98
  Bottom 1.016: L2.1 42.42,52.17 45.59,55.35 v59.44,55.35 60.58,56.49 60.58,60.63 v60.55,60.66 | v60.53,61.98 60.53,60.1 60.6,60.02
VBAT
  Top 0.254: U4.17 17.82,67.78 17.53,68.07 17.53,69.6 17.27,69.85 16.51,69.85 | JP2.1 16.53,70.12 16.51,70.1 16.51,69.6 | C16.A 15.62,66.93 15.75,66.8
  Top 1.422: 16.51,69.6 16.41,69.7 15.9,69.7 15.85,69.65 15.85,69.55 15.8,69.6 10.36,69.6 8.86,68.1 8.86,62.31 7.65,61.09 3.94,61.09 2.64,59.79 2.64,20.93 4.8,18.87 9.96,18.87 11.61,17.22 11.61,11.2 10.9,10.49 10.9,10.36 10.87,10.36 10.21,9.7 10.21,2.85 R5.S-B
  pour Top (no thermals): 16.76,73.41 15.49,73.41 15.24,73.15 15.24,66.29 15.49,66.04 16,66.04 16.26,65.79 16.28,64.06 17.27,64.06 17.27,67.06 17.02,67.31 17.02,73.15
VDD  (via drill 0.6)
  Top 0.305: 30.12,21.6 R8.2 v28.91,22.77 L3.2 | C20.1 18.79,25.72 U2.1 20.42,25.7 20.68,25.45 20.68,23.34 20.5,23.16 U2.3 15.27,23.16 14.35,22.25 14.35,18.97 | 14.35,18.97 14.35,9.39 R5.CCW | v16.21,19 14.38,19 14.35,18.97
  Bottom 0.305: v28.91,22.77 19.98,22.77 18.87,21.67 18.87,19.25 18.62,19 v16.21,19
VOLT
  Top 0.305: R26.2 R25.1 8.61,39.5 9.17,38.94 10.47,38.94 U3.14

### Text on the board
tNames: ZIPS EV | RJ